# EAGLE schematic Desk Clock (EAGLE 7.6.0)
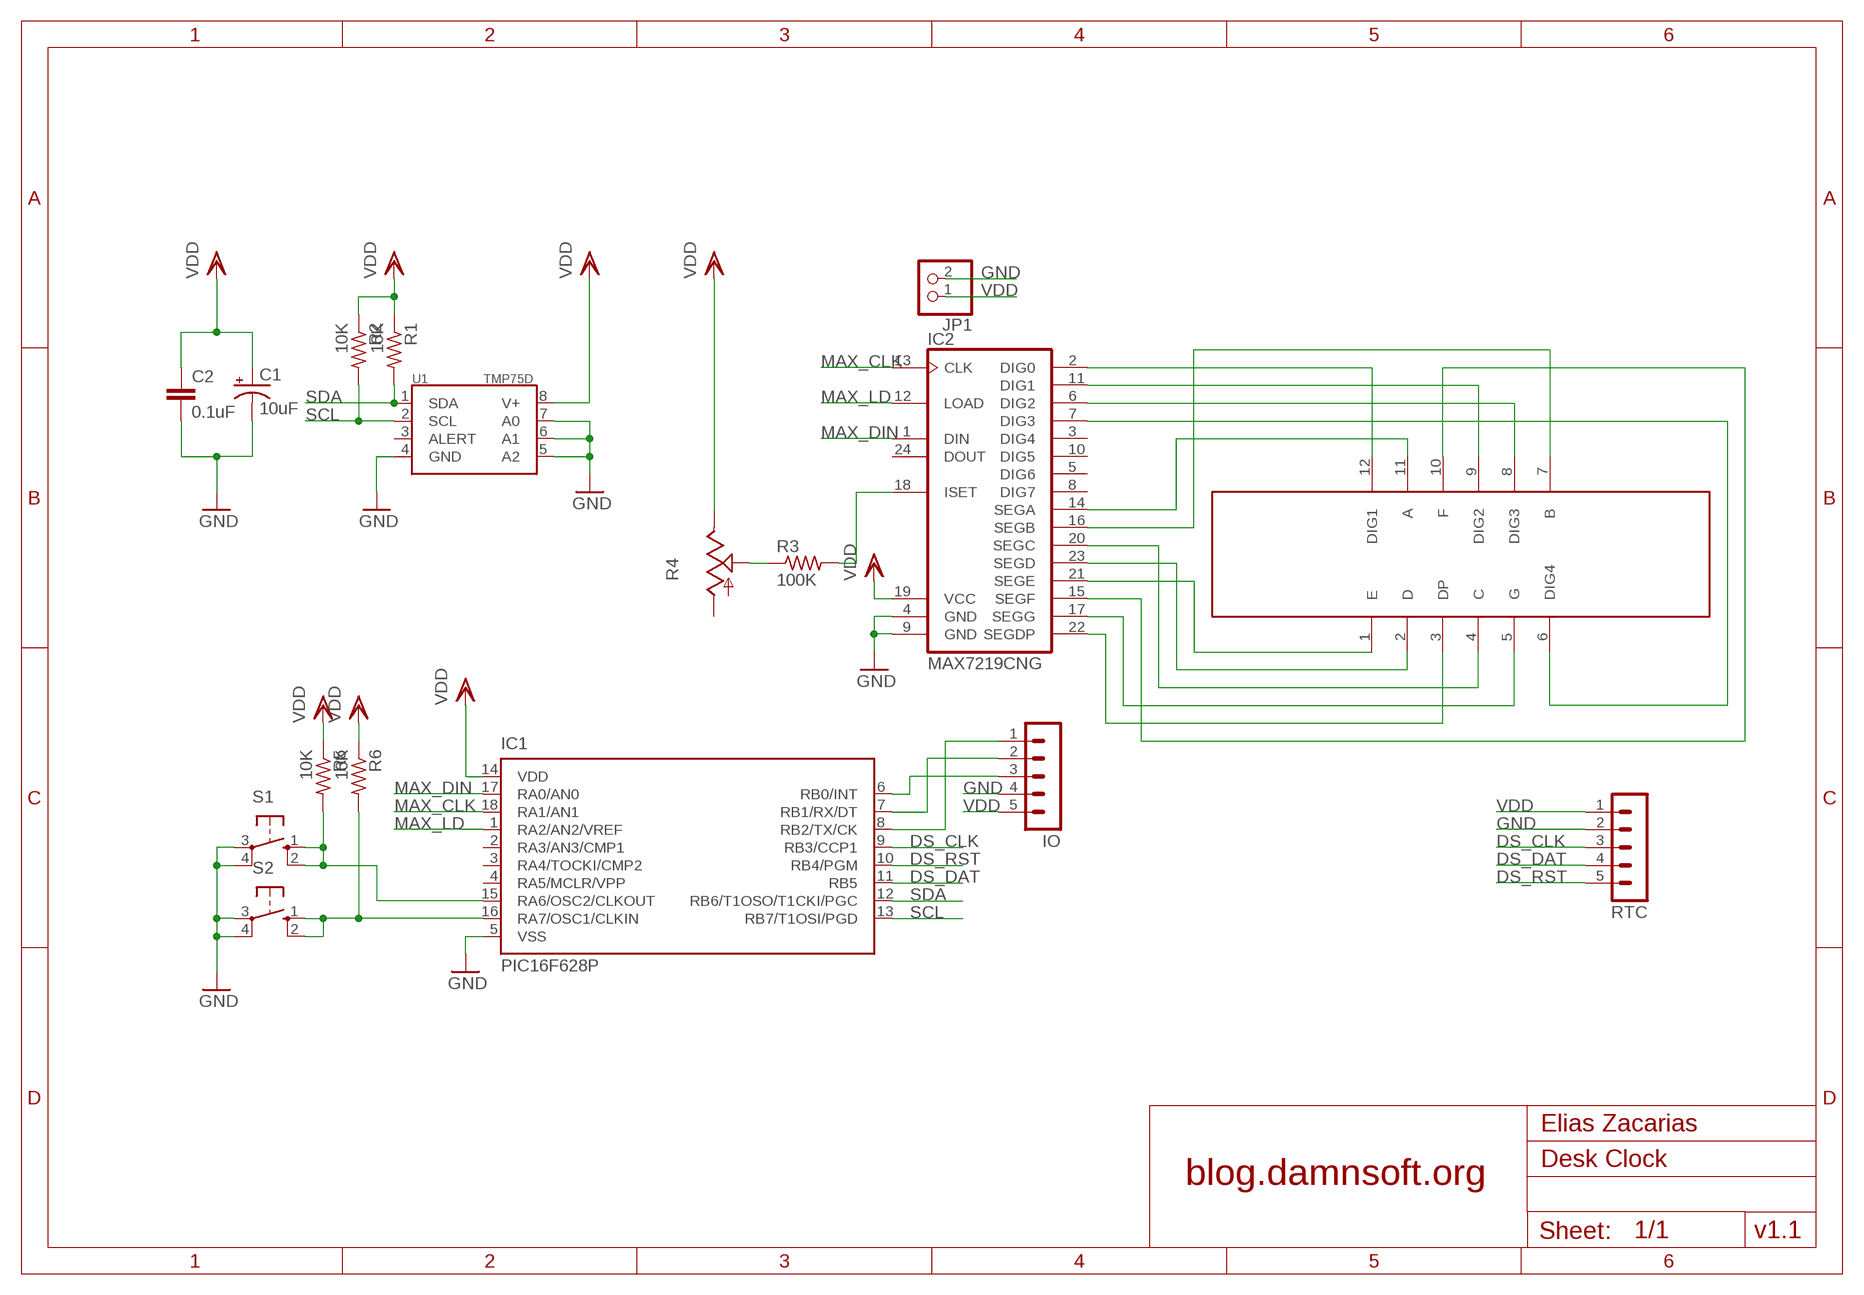
[diagram p0: schematic, sheet 1]

## Parts
C1  10uF  CPOL-USE2-4  [E2-4]
C2  0.1uF  C-EU025-025X050  [C025-025X050]
IC1  PIC16F628P  [DIL18]
IC2  MAX7219CNG  [DIL24-3]
IO  MA05-1  [MA05-1]
JP1  PINHD-1X2  [1X02]
R1  10K  R-US_R0603  [R0603]
R2  10K  R-US_R0603  [R0603]
R3  100K  R-US_0207/7  [0207/7]
R4  TRIM_US-CA6V  [CA6V]
R5  10K  R-US_R0603  [R0603]
R6  10K  R-US_R0603  [R0603]
RTC  MA05-1  [MA05-1]
S1  10-XX  [B3F-10XX]
S2  10-XX  [B3F-10XX]
U1  TMP75D  [SO-08]
U$1  NFD-5642BX  [DISPLAY]

## Nets
$N9: IC1.16(RA7/OSC1/CLKIN) R6.2 S2.1(S) S2.2(S1)
$N18: IC1.15(RA6/OSC2/CLKOUT) R5.2 S1.1(S) S1.2(S1)
DS_CLK: IC1.9(RB3/CCP1) RTC.3
DS_DAT: IC1.11(RB5) RTC.4
DS_RST: IC1.10(RB4/PGM) RTC.5
GND: C1.- C2.2 IC1.5(VSS) IC2.4(GND) IC2.9(GND) IO.4 JP1.2 RTC.2 S1.3(P) S1.4(P1) S2.3(P) S2.4(P1) U1.4(GND) U1.5(A2) U1.6(A1) U1.7(A0)
INT: IC1.6(RB0/INT) IO.3
MAX_CLK: IC1.18(RA1/AN1) IC2.13(CLK)
MAX_DIN: IC1.17(RA0/AN0) IC2.1(DIN)
MAX_LD: IC1.1(RA2/AN2/VREF) IC2.12(LOAD)
N$1: IC2.2(DIG0) U$1.12(DIG1)
N$2: IC2.11(DIG1) U$1.9(DIG2)
N$3: IC2.6(DIG2) U$1.8(DIG3)
N$4: IC2.22(SEGDP) U$1.3(DP)
N$5: IC2.17(SEGG) U$1.5(G)
N$6: IC2.7(DIG3) U$1.6(DIG4)
N$7: IC2.14(SEGA) U$1.11(A)
N$8: IC2.15(SEGF) U$1.10(F)
N$10: IC2.16(SEGB) U$1.7(B)
N$11: IC2.20(SEGC) U$1.4(C)
N$12: IC2.23(SEGD) U$1.2(D)
N$13: IC2.21(SEGE) U$1.1(E)
N$14: IC2.18(ISET) R3.2
N$15: R3.1 R4.S
N$16: IC1.8(RB2/TX/CK) IO.1
N$17: IC1.7(RB1/RX/DT) IO.2
SCL: IC1.13(RB7/T1OSI/PGD) R2.2 U1.2(SCL)
SDA: IC1.12(RB6/T1OSO/T1CKI/PGC) R1.2 U1.1(SDA)
VDD: C1.+ C2.1 IC1.14(VDD) IC2.19(VCC) IO.5 JP1.1 R1.1 R2.1 R4.E R5.1 R6.1 RTC.1 U1.8(V+)
Unconnected: IC1.2(RA3/AN3/CMP1) IC1.3(RA4/TOCKI/CMP2) IC1.4(RA5/MCLR/VPP) IC2.3(DIG4) IC2.5(DIG6) IC2.8(DIG7) IC2.10(DIG5) IC2.24(DOUT) R4.A U1.3(ALERT)

## Notes on the sheet
- Elias Zacarias
- blog.damnsoft.org
- v1.1

## Library data of the parts
C1 = rcl:CPOL-US: POLARIZED CAPACITOR, American symbol
C2 = rcl:C-EU: CAPACITOR, European symbol
IC1 = microchip:PIC16F62*: FLASH-Based 8-Bit CMOS Microcontroller Source: http://ww1.microchip.com/downloads/en/DeviceDoc/40300C.pdf; MF: MICROCHIP; MPN: PIC16F628-04I/P; OC_FARNELL: 9760407; OC_NEWARK: 19C7272
IC2 = maxim:MAX7219CNG: LED DISPLAY DRIVER; MF: MAXIM; MPN: MAX7219CNG; OC_FARNELL: 1523914; OC_NEWARK: 34C4018
IO RTC = con-lstb:MA05-1: PIN HEADER; OC_FARNELL: unknown; OC_NEWARK: unknown
JP1 = pinhead:PINHD-1X2: PIN HEADER
R1-R3 R5 R6 = resistor:R-US_: RESISTOR, American symbol
R4 = pot:TRIM_US-: POTENTIOMETER
S1 S2 = switch-omron:10-XX: OMRON SWITCH; MPN: B3F-1000; OC_FARNELL: 176432; OC_NEWARK: 36M3542
U1 = ti_tmp:TMP75
U$1 = NFD-5642Xx:NFD-5642BX